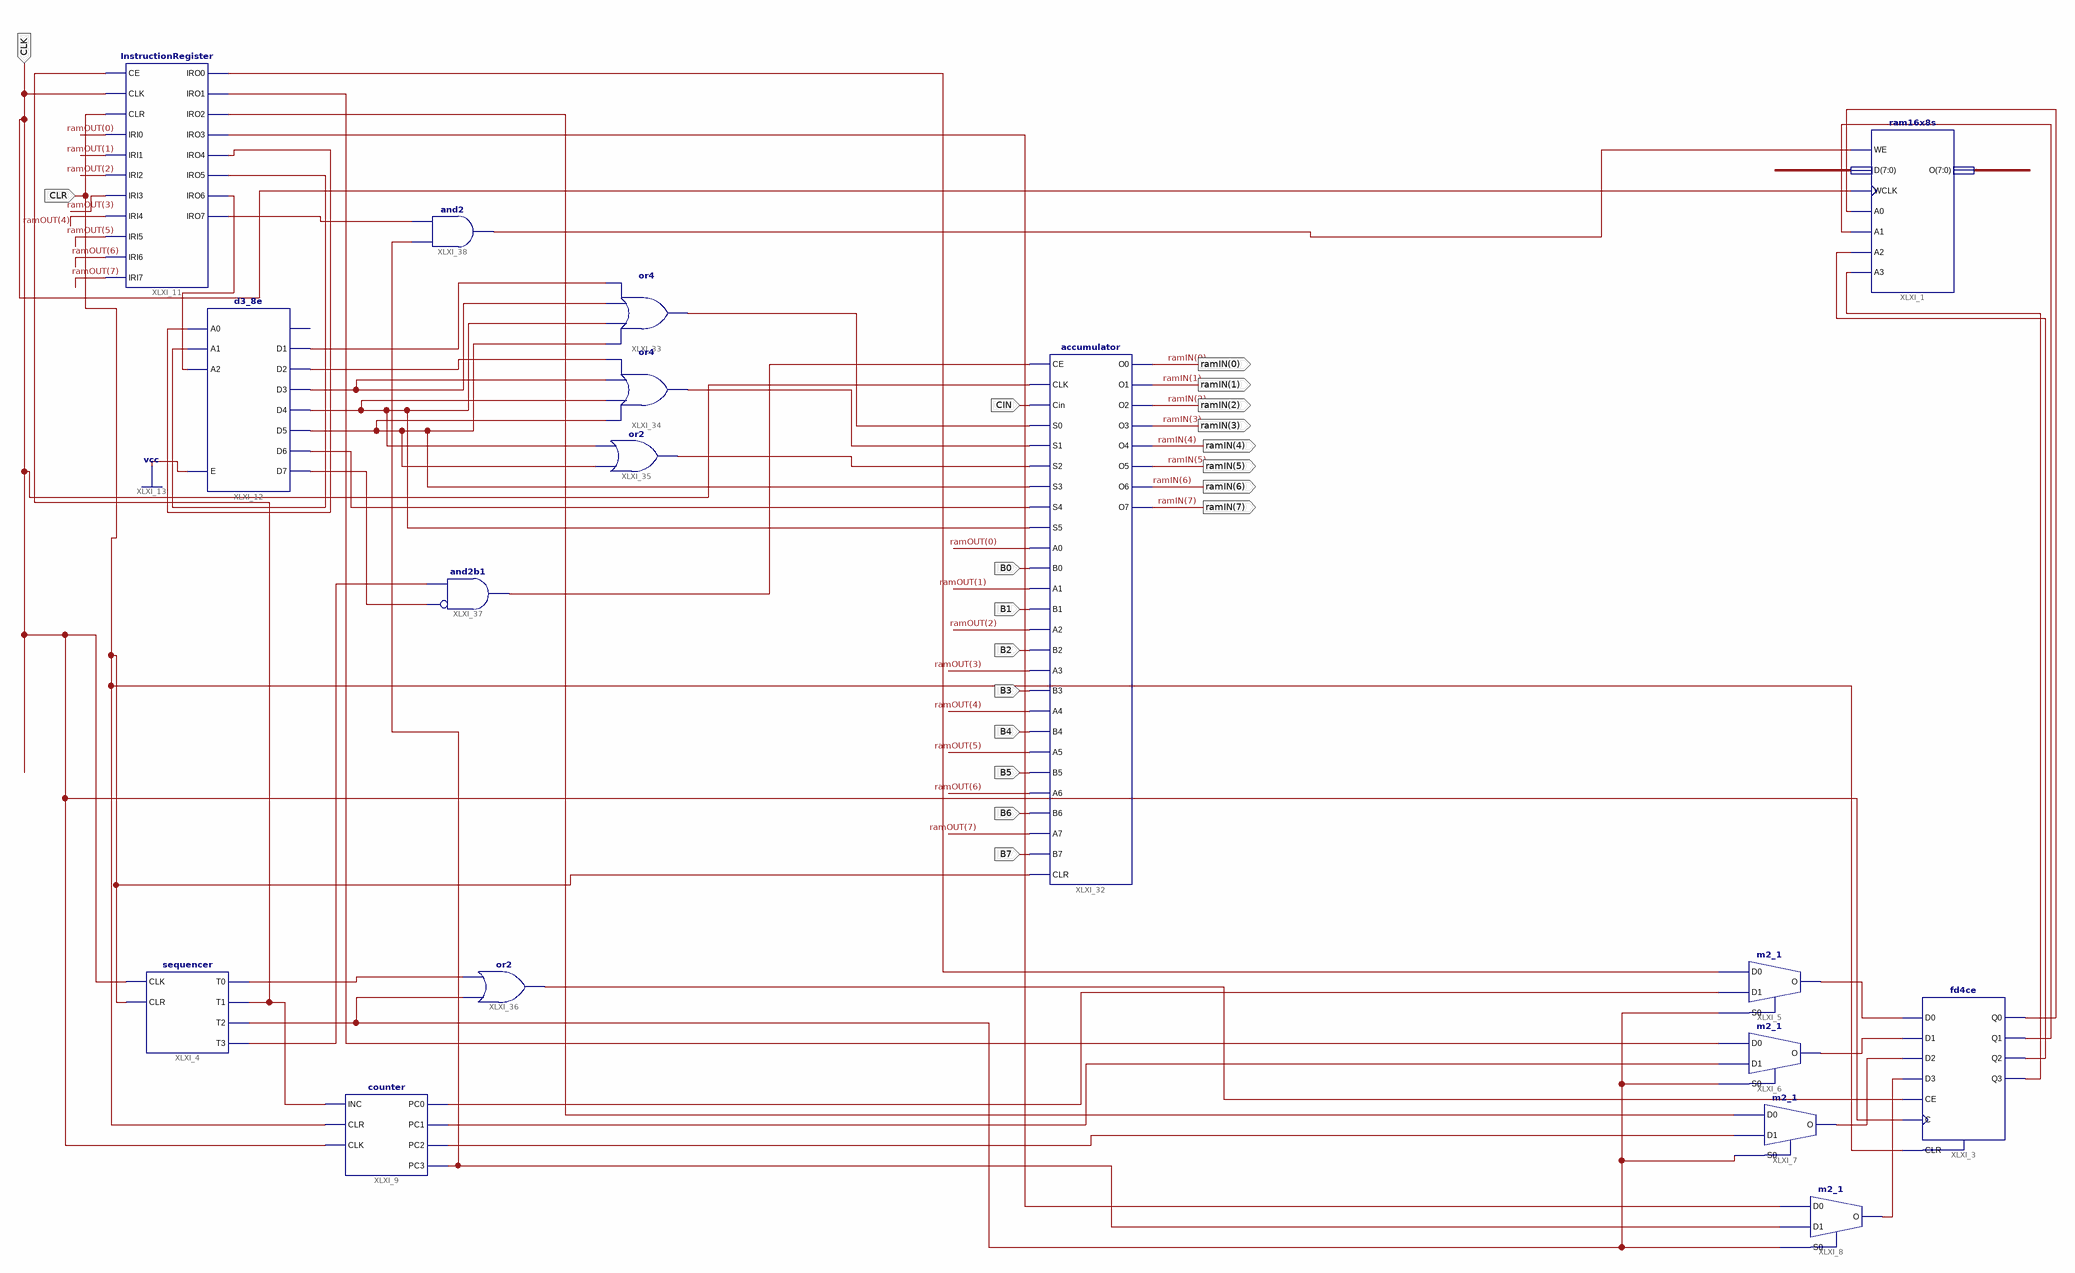
[diagram p0: schematic sheet 1]
// Xilinx ISE schematic main.sch (spartan3e) as structural Verilog: 17 symbols, 19 ports
module main (
  input  CLK,
  input  CLR,
  input  B0,
  input  B1,
  input  B2,
  input  B3,
  input  B4,
  input  B5,
  input  B6,
  input  B7,
  input  CIN,
  output [7:0] ramIN
);

  wire XLXN_1, XLXN_2, XLXN_3, XLXN_4, XLXN_5, XLXN_6, XLXN_7, XLXN_8, XLXN_34, XLXN_35, XLXN_36, XLXN_94,
       XLXN_95, XLXN_96, XLXN_97, XLXN_101, XLXN_102, XLXN_107, XLXN_108, XLXN_109, XLXN_112, XLXN_113,
       XLXN_114, XLXN_116, XLXN_117, XLXN_118, XLXN_119, XLXN_120, XLXN_121, XLXN_122, XLXN_127, XLXN_128,
       XLXN_129, XLXN_130, XLXN_131, XLXN_133, XLXN_134;
  wire [7:0] ramOUT;

  InstructionRegister XLXI_11 (
    .CE(XLXN_119), .CLK(CLK), .CLR(CLR), .IRI0(ramOUT[0]), .IRI1(ramOUT[1]), .IRI2(ramOUT[2]),
    .IRI3(ramOUT[3]), .IRI4(ramOUT[4]), .IRI5(ramOUT[5]), .IRI6(ramOUT[6]), .IRI7(ramOUT[7]),
    .IRO0(XLXN_127), .IRO1(XLXN_128), .IRO2(XLXN_129), .IRO3(XLXN_130), .IRO4(XLXN_34), .IRO5(XLXN_35),
    .IRO6(XLXN_36), .IRO7(XLXN_131));
  d3_8e XLXI_12 (
    .A0(XLXN_34), .A1(XLXN_35), .A2(XLXN_36), .E(1'b1), .D1(XLXN_94), .D2(XLXN_101), .D3(XLXN_102),
    .D4(XLXN_109), .D5(XLXN_107), .D6(XLXN_108), .D7(XLXN_116));  // open: D0
  ram16x8s #(.INIT_07("c5b1"), .INIT_06("36b2"), .INIT_05("6c23"), .INIT_04("a8a4"), .INIT_03("aaaa"), .INIT_02("cccc"), .INIT_01("f0f0"), .INIT_00("8080")) XLXI_1 (
    .A0(XLXN_1), .A1(XLXN_2), .A2(XLXN_3), .A3(XLXN_4), .D(ramIN), .WCLK(CLK), .WE(XLXN_133), .O(ramOUT));
  sequencer XLXI_4 (.CLK(CLK), .CLR(CLR), .T0(XLXN_112), .T1(XLXN_119), .T2(XLXN_113), .T3(XLXN_117));
  counter XLXI_9 (.CLK(CLK), .CLR(CLR), .INC(XLXN_119), .PC0(XLXN_120), .PC1(XLXN_121), .PC2(XLXN_122), .PC3(XLXN_134));
  fd4ce XLXI_3 (
    .C(CLK), .CE(XLXN_114), .CLR(CLR), .D0(XLXN_5), .D1(XLXN_6), .D2(XLXN_7), .D3(XLXN_8), .Q0(XLXN_1),
    .Q1(XLXN_2), .Q2(XLXN_3), .Q3(XLXN_4));
  m2_1 XLXI_5 (.D0(XLXN_127), .D1(XLXN_120), .S0(XLXN_113), .O(XLXN_5));
  m2_1 XLXI_6 (.D0(XLXN_128), .D1(XLXN_121), .S0(XLXN_113), .O(XLXN_6));
  m2_1 XLXI_7 (.D0(XLXN_129), .D1(XLXN_122), .S0(XLXN_113), .O(XLXN_7));
  m2_1 XLXI_8 (.D0(XLXN_130), .D1(XLXN_134), .S0(XLXN_113), .O(XLXN_8));
  accumulator XLXI_32 (
    .A0(ramOUT[0]), .A1(ramOUT[1]), .A2(ramOUT[2]), .A3(ramOUT[3]), .A4(ramOUT[4]), .A5(ramOUT[5]),
    .A6(ramOUT[6]), .A7(ramOUT[7]), .B0(B0), .B1(B1), .B2(B2), .B3(B3), .B4(B4), .B5(B5), .B6(B6), .B7(B7),
    .CE(XLXN_118), .Cin(CIN), .CLK(CLK), .CLR(CLR), .O0(ramIN[0]), .O1(ramIN[1]), .O2(ramIN[2]),
    .O3(ramIN[3]), .O4(ramIN[4]), .O5(ramIN[5]), .O6(ramIN[6]), .O7(ramIN[7]), .S0(XLXN_95), .S1(XLXN_96),
    .S2(XLXN_97), .S3(XLXN_107), .S4(XLXN_108), .S5(XLXN_109));
  or XLXI_33 (XLXN_95, XLXN_107, XLXN_109, XLXN_102, XLXN_94);
  or XLXI_34 (XLXN_96, XLXN_107, XLXN_109, XLXN_102, XLXN_101);
  or XLXI_35 (XLXN_97, XLXN_107, XLXN_109);
  or XLXI_36 (XLXN_114, XLXN_113, XLXN_112);
  and XLXI_37 (XLXN_118, ~XLXN_116, XLXN_117);  // and2b1
  and XLXI_38 (XLXN_133, XLXN_134, XLXN_131);
endmodule
